# Altium project WheelMotorBoard.PrjPCB
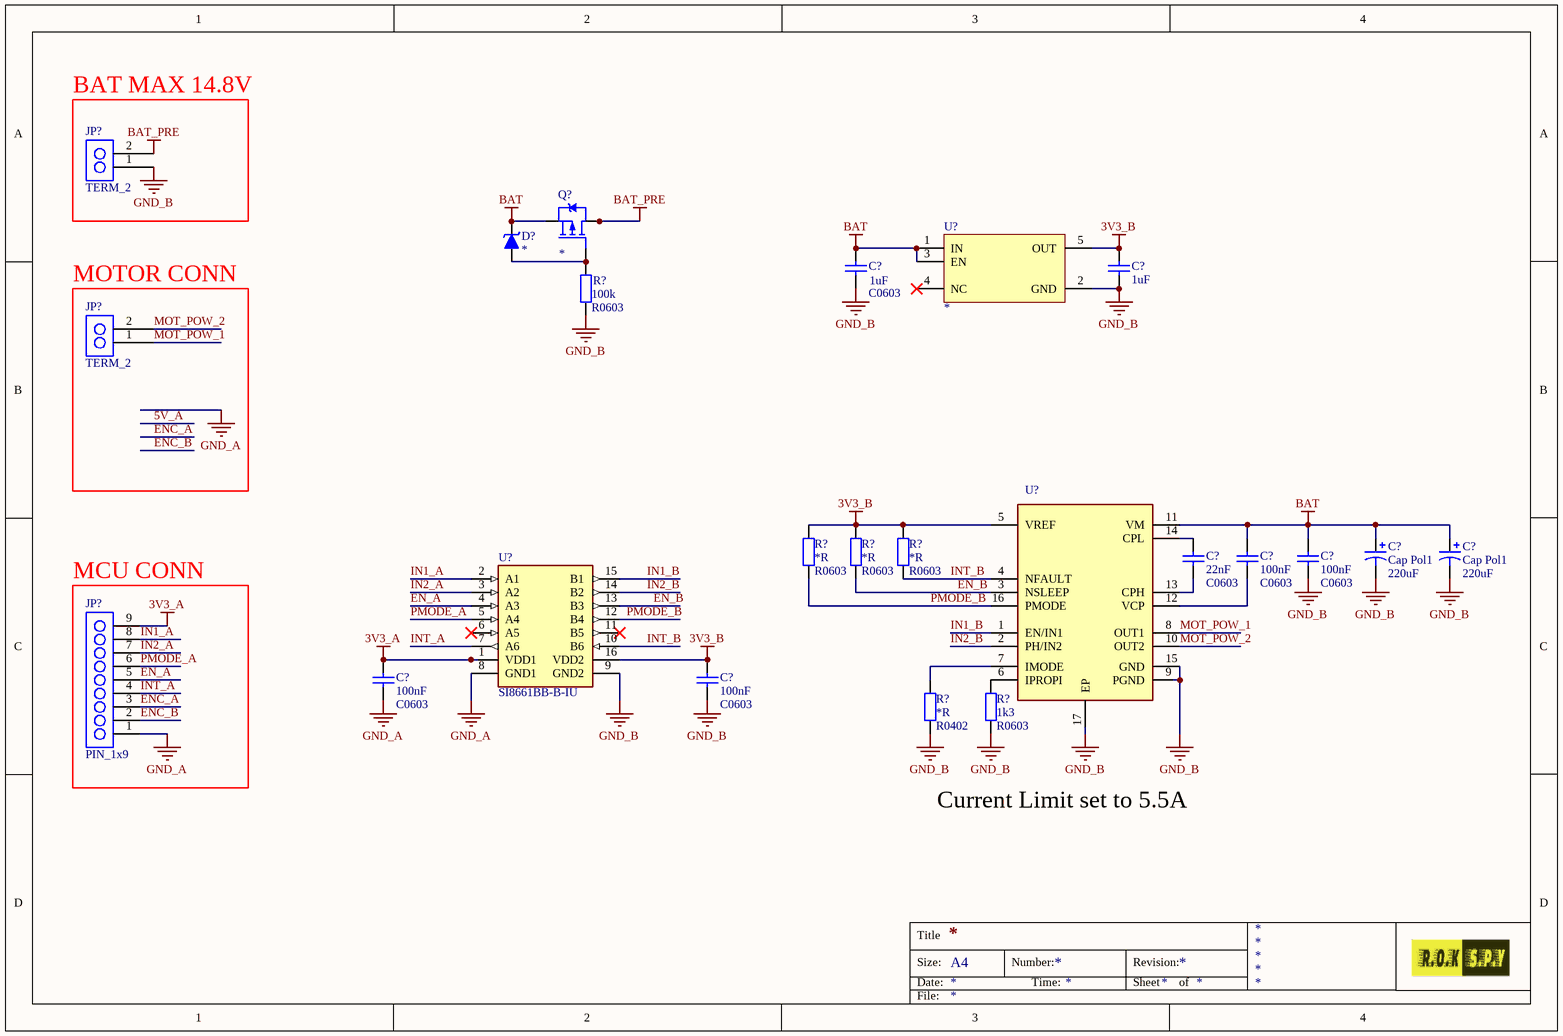
[diagram p0: WheelMotorBoard.SchDoc]
1 sheet, 23 parts. Net scope: global (net labels, ports and power ports of the same name join across sheets).
Board file: WheelMotorBoard.PcbDoc

## Sheet WheelMotorBoard.SchDoc
size A4

### Parts
(Parts that share a designator on the sheet are numbered #1, #2 ... from top to bottom, then left to right.)
C?#1  Capacitance: 1uF  [C0603]
C?#2  Capacitance: 1uF  [C0603]
C?#3  Cap Pol1  value 220uF  [RB7.6-15]
C?#4  Cap Pol1  value 220uF  [RB7.6-15]
C?#5  Capacitance: 22nF  [C0603]
C?#6  Capacitance: 100nF  [C0603]
C?#7  Capacitance: 100nF  [C0603]
C?#8  Capacitance: 100nF  [C0603]
C?#9  Capacitance: 100nF  [C0603]
D?  *
JP?#1  TERM_2  [TERMINAL 2P]
JP?#2  TERM_2  [TERMINAL 2P]
JP?#3  PIN_1x9  [2.54_1X9H]
Q?  *
R?#1  100k  [R0603]
R?#2  *R  [R0603]
R?#3  *R  [R0603]
R?#4  *R  [R0603]
R?#5  *R  [R0402]
R?#6  1k3  [R0603]
U?#1  *  [SOT23-5]
U?#2  DRV8874PWPR  [SOP65P640X120-17N]  (value not drawn)
U?#3  SI8661BB-B-IU  [SOP64P600X175-16N]

### Blocks framed on the sheet
BAT MAX 14.8V: JP?#1
MOTOR CONN: JP?#2
MCU CONN: JP?#3

### Nets
3V3_A: C?#8.2 JP?#3.9 U?#3.1(VDD1)
3V3_B: C?#2.2 C?#9.2 R?#2.2 R?#3.2 R?#4.2 U?#1.5(OUT) U?#2.5(VREF) U?#3.16(VDD2)
BAT: C?#1.2 C?#3.1 C?#4.1 C?#6.2 C?#7.2 D?.2(A) Q?.S1(S) U?#1.1(IN) U?#1.3(EN) U?#2.11(VM)
BAT_PRE: JP?#1.2 Q?.D0(D) Q?.D1(D) Q?.D2(D) Q?.D3(D)
GND_A: C?#8.1 JP?#3.1 U?#3.8(GND1)
GND_B: C?#1.1 C?#2.1 C?#3.2 C?#4.2 C?#7.1 C?#9.1 JP?#1.1 R?#1.1 R?#5.1 R?#6.1 U?#1.2(GND) U?#2.9(PGND) U?#2.15(GND) U?#2.17(EP) U?#3.9(GND2)
EN_A: JP?#3.5 U?#3.4(A3)
EN_B: R?#3.1 U?#2.3(NSLEEP) U?#3.13(B3)
ENC_A: JP?#3.3
ENC_B: JP?#3.2
IN1_A: JP?#3.8 U?#3.2(A1)
IN1_B: U?#2.1(EN/IN1) U?#3.15(B1)
IN2_A: JP?#3.7 U?#3.3(A2)
IN2_B: U?#2.2(PH/IN2) U?#3.14(B2)
INT_A: JP?#3.4 U?#3.7(A6)
INT_B: R?#4.1 U?#2.4(NFAULT) U?#3.10(B6)
MOT_POW_1: JP?#2.1 U?#2.8(OUT1)
MOT_POW_2: JP?#2.2 U?#2.10(OUT2)
PMODE_A: JP?#3.6 U?#3.5(A4)
PMODE_B: R?#2.1 U?#2.16(PMODE) U?#3.12(B4)
NetC?#5_1: C?#5.1 U?#2.13(CPH)
NetC?#5_2: C?#5.2 U?#2.14(CPL)
NetC?#6_1: C?#6.1 U?#2.12(VCP)
NetD?_1: D?.1(K) Q?.G R?#1.2
NetR?#5_2: R?#5.2 U?#2.7(IMODE)
NetR?#6_2: R?#6.2 U?#2.6(IPROPI)

Not connected (* = marked no-connect by the designer): U?#1 4(NC)*; U?#3 6(A5)* 11(B5)*

### Notes on the sheet
- Current Limit set to 5.5A
- Title
- Size:
- Date:
- A4
- Number:
- Time:
- Revision:
- Sheet
- of
- File:

### Library data of the parts
C?#1 C?#2 C?#5-C?#9 = Capacitor: Ceramic capacitor; Type: MLCC; Voltage rating: *V; ComponentLinknDescription: Datasheet; Characteristic: *; Manufacturer: *; ComponentLinknURL: *
  C?#1 C?#5-C?#9: Note: C0603
C?#3 C?#4 = Cap Pol1: Polarized Capacitor (Radial); Published: 8-Jun-2000; LatestRevisionDate: 17-Jul-2002; LatestRevisionNote: Re-released for DXP Platform.; PackageReference: RB7.6-15; Publisher: Altium Limited; PackageDescription: Polarized Capacitor (Radial); 2 Leads
D? = Zenner Diode: PartNumber: *; Parameter 2: *; Parameter 3: *; Parameter 4: *; Farnell Order Nr: *; Zenner Voltage: *
Q? = P-Channel MOSFET: PartNumber: *; GS breakdown Volt: *; Farnell Order Nr: *; DS Breakdown Volt: *; Drain Current: *; rDSon: *; Parameter 2: *; Parameter 3: *; Datasheet: *
R?#1-R?#6 = Resistor: Precision: *%; Voltage rating: *V; Temp coefficient: *ppm; Power rating: *mW; ComponentLinknDescription: Datasheet; Manufacturer: *; ComponentLinknURL: *
  R?#1: Resistance: 100k; Note: R0603
  R?#2-R?#4: Resistance: *R; Note: R0603
  R?#5: Resistance: *R; Note: R0402
  R?#6: Resistance: 1k3; Note: R0603
U?#1 = MIC5225: LDO Voltage Regulator; Manufacturer: Microchip; Accuracy: 2%; Input Max Voltage: 16V; Output Current: 150mA; ComponentLink1Description: Datasheet; ComponentLink1URL: https://eu.mouser.com/datasheet/2/268/mic5225-1082288.pdf; Created By: Roberts Oskars Komarovskis; Farnell Order Nr: 2510263; PartNumber: *
U?#2 = DRV8874PWPR: DRV8874H-BridgeMotorDriverWith IntegratedCurrentSenseand Regulation; Manufacturer_Name: Texas Instruments; Datasheet Link: https://www.ti.com/lit/gpn/DRV8874; Height: 1.2mm; Manufacturer_Part_Number: DRV8874PWPR; ComponentLink1Description: Datasheet; ComponentLink1URL: https://www.ti.com/lit/gpn/DRV8874
U?#3 = SI8661BB-B-IU: Connector; Manufacturer_Name: Silicon Labs; Datasheet Link: https://componentsearchengine.com//SI8661BB-B-IU.pdf; Height: 1.75mm; Mouser2 Part Number: 634-SI8661BB-B-IU; Mouser2 Price/Stock: https://www.mouser.com/Search/Refine.aspx?Keyword=634-SI8661BB-B-IU; Manufacturer_Part_Number: SI8661BB-B-IU; ComponentLink1Description: Datasheet; ComponentLink1URL: https://4donline.ihs.com/images/VipMasterIC/IC/SILC/SILC-S-A0009375737/SILC-S-A0009375737-1.pdf?hkey=6D3A4C79FDBF58556ACFDE234799DDF0; Farnell Order Nr: 3387122
JP?#3 = PIN_1x9: Manufacturer: *; Part Number: *; ComponentLinknDescription: *; ComponentLinknURL: *; Drawn By: Erik Ilbis